# Altium schematic sheet ch55x.SchDoc
size A3
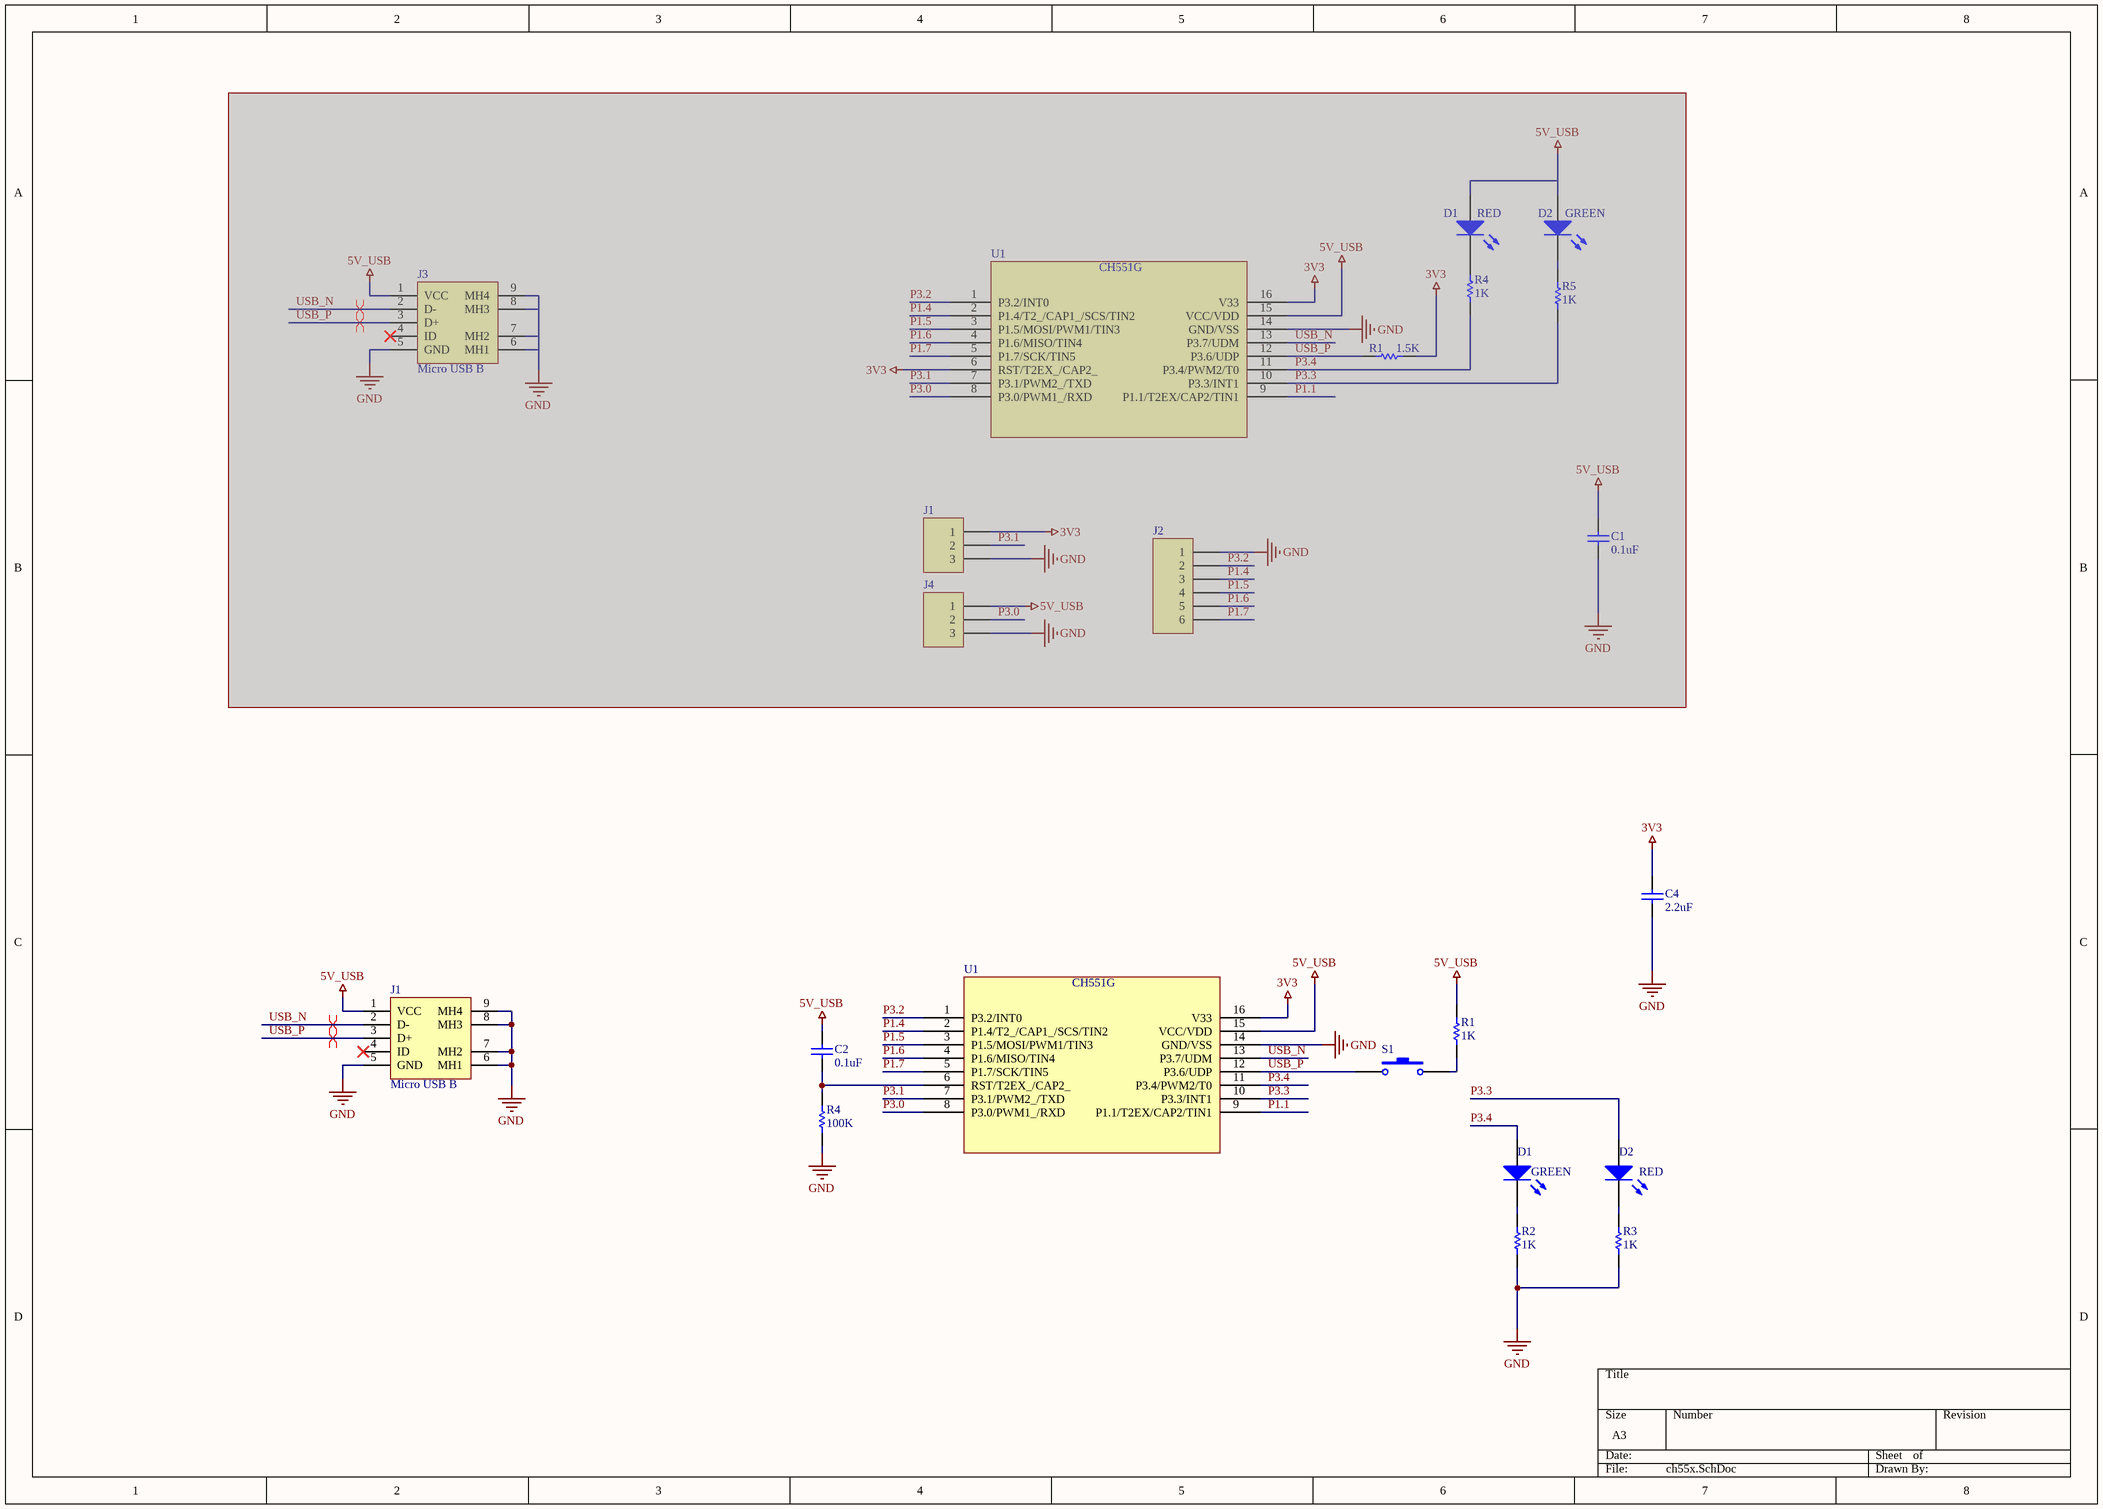
[diagram p0: ch55x.SchDoc]

## Parts
(Parts that share a designator on the sheet are numbered #1, #2 ... from top to bottom, then left to right.)
C1  value 0.1uF  [0603_C]  (hidden comment: C0603)  (masked out: inside a compile mask, not in the netlist)
C2  value 0.1uF  [0603_C]  (hidden comment: C0603)
C4  value 2.2uF  [0603_C]  (hidden comment: C0603)
D1#1  RED  [LED 0603R]  (masked out: inside a compile mask, not in the netlist)
D1#2  GREEN  [0603_LED]
D2#1  GREEN  [LED 0603G]  (masked out: inside a compile mask, not in the netlist)
D2#2  RED  [0603_LED]
J1#1  Header 4  [HEADER_3x1]  (value not drawn)  (masked out: inside a compile mask, not in the netlist)
J1#2  Micro USB B  [MICRO_USB]
J2  Header 4  [HEADER_6x1]  (value not drawn)  (masked out: inside a compile mask, not in the netlist)
J3  Micro USB B  [MICRO_USB]  (masked out: inside a compile mask, not in the netlist)
J4  Header 4  [HEADER_3x1]  (value not drawn)  (masked out: inside a compile mask, not in the netlist)
logo  logo  [LOGO_MUSELAB]  (value not drawn)  (masked out: inside a compile mask, not in the netlist)
R1#1  value 1.5K  [0603_R]  (hidden comment: R0603)  (masked out: inside a compile mask, not in the netlist)
R1#2  value 1K  [0603_R]  (hidden comment: R0603)
R2  value 1K  [0603_R]  (hidden comment: R0603)
R3  value 1K  [0603_R]  (hidden comment: R0603)
R4#1  value 1K  [0603_R]  (hidden comment: R0603)  (masked out: inside a compile mask, not in the netlist)
R4#2  value 100K  [0603_R]  (hidden comment: R0603)
R5  value 1K  [0603_R]  (hidden comment: R0603)  (masked out: inside a compile mask, not in the netlist)
S1  SW-PB  [SMT_SW_PTS_820]  (value not drawn)
U1#1  CH551G  [SOP16N_M]  (value not drawn)  (masked out: inside a compile mask, not in the netlist)
U1#2  CH551G  [SOP16N_M]  (value not drawn)

## Nets
3V3: C4.2 U1#2.16(V33)
5V_USB: C2.2 J1#2.1(VCC) R1#2.1 U1#2.15(VCC/VDD)
GND: C4.1 J1#2.5(GND) J1#2.6(MH1) J1#2.7(MH2) J1#2.8(MH3) J1#2.9(MH4) R2.1 R3.1 R4#2.1 U1#2.14(GND/VSS)
P1.1: U1#2.9(P1.1/T2EX/CAP2/TIN1)
P1.4: U1#2.2(P1.4/T2_/CAP1_/SCS/TIN2)
P1.5: U1#2.3(P1.5/MOSI/PWM1/TIN3)
P1.6: U1#2.4(P1.6/MISO/TIN4)
P1.7: U1#2.5(P1.7/SCK/TIN5)
P3.0: U1#2.8(P3.0/PWM1_/RXD)
P3.1: U1#2.7(P3.1/PWM2_/TXD)
P3.2: U1#2.1(P3.2/INT0)
P3.3: D2#2.1(A) U1#2.10(P3.3/INT1)
P3.4: D1#2.1(A) U1#2.11(P3.4/PWM2/T0)
USB_N: J1#2.2(D-) U1#2.13(P3.7/UDM)
USB_P: J1#2.3(D+) S1.1 U1#2.12(P3.6/UDP)
NetC2_1: C2.1 R4#2.2 U1#2.6(RST/T2EX_/CAP2_)
NetD1#2_2: D1#2.2(K) R2.2
NetD2#2_2: D2#2.2(K) R3.2
NetR1#2_2: R1#2.2 S1.2

Not connected (* = marked no-connect by the designer): J1#2 4(ID)*

## Layout directives
differential pair: (no net found under the mark), USB_N, USB_P

## Library data of the parts
C1 C2 C4 = C0603: Capacitor; Published: 8-Jun-2000; LatestRevisionDate: 17-Jul-2002; LatestRevisionNote: Re-released for DXP Platform.; PackageReference: RAD-0.3; Publisher: Altium Limited; PackageDescription: Radial Cap, Thru-Hole; 2 Leads; 0.3 in Pin Spacing
D1#1 D1#2 D2#1 D2#2 = D0603: Typical RED, GREEN, YELLOW, AMBER GaAs LED; Published: 8-Jun-2000; LatestRevisionDate: 17-Jul-2002; LatestRevisionNote: Re-released for DXP Platform.; PackageVersion: Feb-2002; PackageReference: 3.2X1.6X1.1; Publisher: Altium Limited; PackageDescription: SM LED; 2 Flat Leads
J1#1 J4 = Header 3: Header, 4-Pin; LatestRevisionDate: 17-Jul-2002; LatestRevisionNote: Re-released for DXP Platform.; Publisher: Altium Limited
J2 = Header 6: Header, 4-Pin; LatestRevisionDate: 17-Jul-2002; LatestRevisionNote: Re-released for DXP Platform.; Publisher: Altium Limited
R1#1 R1#2 R2 R3 R4#1 R4#2 R5 = R0603: Resistor; Published: 8-Jun-2000; LatestRevisionDate: 17-Jul-2002; LatestRevisionNote: Re-released for DXP Platform.; PackageReference: AXIAL-0.3; Publisher: Altium Limited; PackageDescription: Axial Device, Thru-Hole; 2 Leads; 0.3 in Pin Spacing
S1 = SW-PB: Switch; Published: 24-Mar-1999; LatestRevisionDate: 17-Jul-2002; LatestRevisionNote: Re-released for DXP Platform.; PackageReference: SPST-2; Publisher: Altium Limited; PackageDescription: Switch; 2 Leads